# EAGLE design Qwiic-OpenLog (EAGLE 9.2.0)
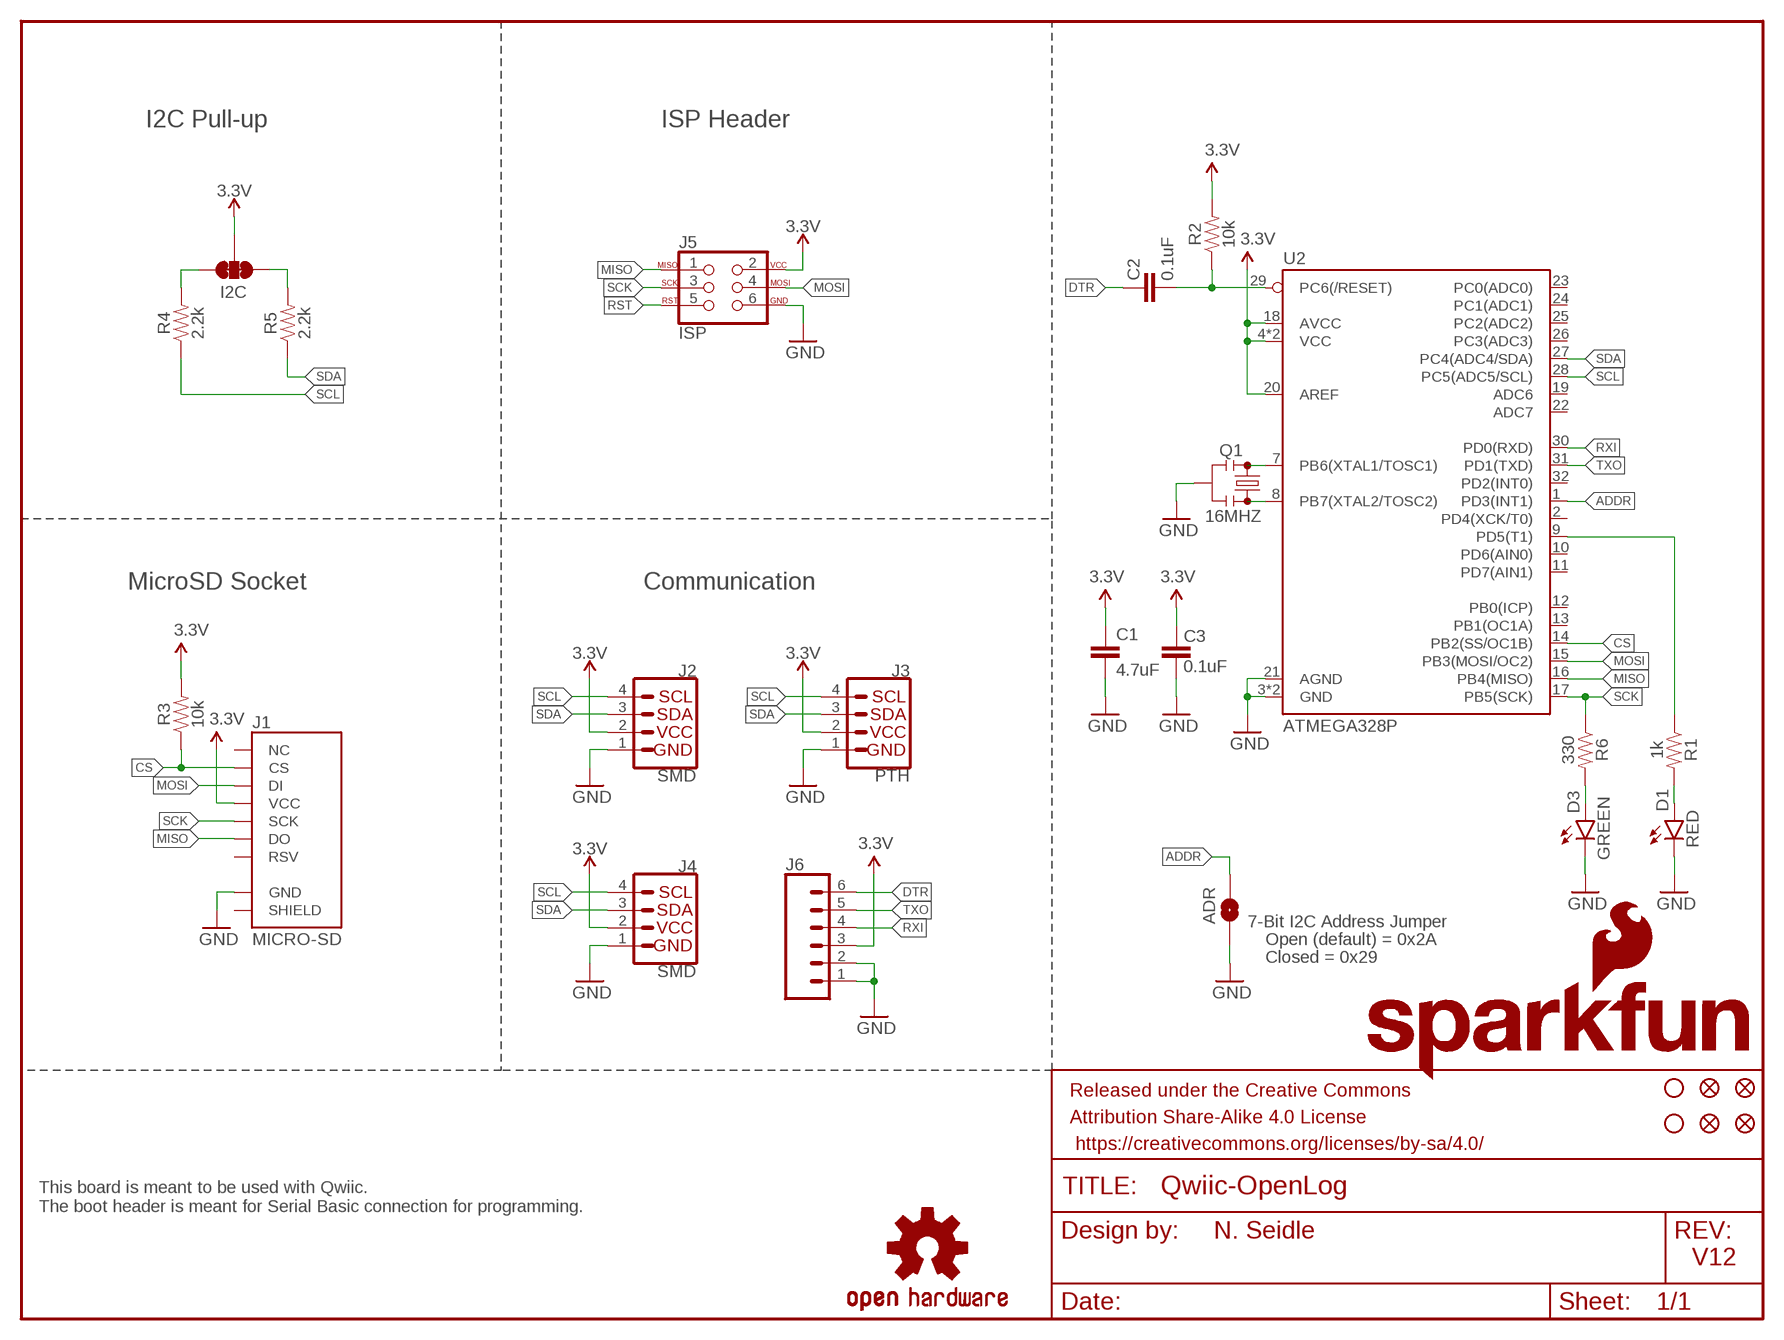
[diagram p0: schematic, sheet 1]

## Parts
ADR  SOLDERJUMPERNO  [SJ_2S-NO]
C1  4.7uF  4.7UF-0603-6.3V-(10%)  [0603]
C2  0.1uF  0.1UF-0603-25V-(+80/-20%)  [0603]
C3  0.1uF  0.1UF-0603-25V-(+80/-20%)  [0603]
D1  RED  LED-RED0603  [LED-0603]
D3  GREEN  LED-GREEN0603  [LED-0603]
FID1  FIDUCIALUFIDUCIAL  [FIDUCIAL-MICRO]
FID2  FIDUCIALUFIDUCIAL  [FIDUCIAL-MICRO]
FID3  FIDUCIALUFIDUCIAL  [FIDUCIAL-MICRO]
FID4  FIDUCIALUFIDUCIAL  [FIDUCIAL-MICRO]
FRAME1  FRAME-LETTER  [CREATIVE_COMMONS]
I2C  JUMPER-SMT_3_2-NC_TRACE_SILK  [SMT-JUMPER_3_2-NC_TRACE_SILK]
J1  MICRO-SD  MICRO-SD_CARD_SOCKETPUSH-PUSH  [MICRO-SD-SOCKET]
J2  SMD  QWIIC_CONNECTORJS-1MM  [1X04_1MM_RA]
J3  PTH  I2C_STANDARD_NO_SILK  [1X04_NO_SILK]
J4  SMD  QWIIC_CONNECTORJS-1MM  [1X04_1MM_RA]
J5  ISP  AVR_SPI_PROG_3X2TESTPOINTS  [2X3_TEST_POINTS]
J6  CONN_06NO_SILK_NO_POP  [1X06_NO_SILK]
JP3  STAND-OFF  [STAND-OFF]
JP4  STAND-OFF  [STAND-OFF]
LOGO1  SFE_LOGO_FLAME.1_INCH  [SFE_LOGO_FLAME_.1]
LOGO2  OSHW-LOGOMINI  [OSHW-LOGO-MINI]
LOGO4  SFE_LOGO_NAME_FLAME.1_INCH  [SFE_LOGO_NAME_FLAME_.1]
Q1  16MHZ  RESONATOR16MHZ  [RESONATOR-SMD]
R1  1k  1KOHM-0603-1/10W-1%  [0603]
R2  10k  10KOHM-0603-1/10W-1%  [0603]
R3  10k  10KOHM-0603-1/10W-1%  [0603]
R4  2.2k  2.2KOHM-0603-1/10W-1%  [0603]
R5  2.2k  2.2KOHM-0603-1/10W-1%  [0603]
R6  330  330OHM-0603-1/10W-1%  [0603]
U2  ATMEGA328P  ATMEGA328P_TQFP  [TQFP32-08]

## Nets
3.3V: C1.1 C3.2 I2C.2 J1.VCC J2.2 J3.2(VCC) J4.2 J5.2 J6.3 R2.2 R3.2 U2.4(VCC) U2.6(VCC) U2.18(AVCC) U2.20(AREF)
ADDR: ADR.2 U2.1(PD3(INT1))
CS: J1.CS R3.1 U2.14(PB2(SS/OC1B))
DTR: C2.2 J6.6
GND [vcc]: ADR.1 C1.2 C3.1 D1.C D3.C J1.GND J2.1 J3.1(GND) J4.1 J5.6 J6.1 J6.2 Q1.2 U2.3(GND) U2.5(GND) U2.21(AGND)
MISO: J1.DO J5.1 U2.16(PB4(MISO))
MOSI: J1.DI J5.4 U2.15(PB3(MOSI/OC2))
N$1: Q1.1 U2.8(PB7(XTAL2/TOSC2))
N$2: Q1.3 U2.7(PB6(XTAL1/TOSC1))
N$3: D1.A R1.2
N$4: R1.1 U2.9(PD5(T1))
N$5: I2C.1 R5.2
N$6: I2C.3 R4.2
N$7: D3.A R6.2
RST: C2.1 J5.5 R2.1 U2.29(PC6(/RESET))
RXI: J6.4 U2.30(PD0(RXD))
SCK: J1.SCLK(SCK) J5.3 R6.1 U2.17(PB5(SCK))
SCL: J2.4 J3.4(SCL) J4.4 R4.1 U2.28(PC5(ADC5/SCL))
SDA: J2.3 J3.3(SDA) J4.3 R5.1 U2.27(PC4(ADC4/SDA))
TXO: J6.5 U2.31(PD1(TXD))
Unconnected: J1.CD1(SHIELD) J1.RSV1(RSV) J1.RSV2(NC) U2.2(PD4(XCK/T0)) U2.10(PD6(AIN0)) U2.11(PD7(AIN1)) U2.12(PB0(ICP)) U2.13(PB1(OC1A)) U2.19(ADC6) U2.22(ADC7) U2.23(PC0(ADC0)) U2.24(PC1(ADC1)) U2.25(PC2(ADC2)) U2.26(PC3(ADC3)) U2.32(PD2(INT0))

## Notes on the sheet
- I2C Pull-up | ISP Header
- MicroSD Socket | Communication
- 7-Bit I2C Address Jumper
- Open (default) = 0x2A
- Closed = 0x29
- This board is meant to be used with Qwiic. 
  The boot header is meant for Serial Basic connection for programming.
- N. Seidle
- V12

## Library data of the parts
ADR = SparkFun:SOLDERJUMPER: Solder Jumper Standard SMD solder jumper. Used to automate production. Two varients : Normally Open and Normally Closed are the same, but have different paste layers. NC will have a large amount of paste and should jumper during reflow.
C1 = SparkFun-Capacitors:4.7UF: 4.7µF ceramic capacitors A capacitor is a passive two-terminal electrical component used to store electrical energy temporarily in an electric field.; PROD_ID: CAP-08280
C2 C3 = SparkFun-Capacitors:0.1UF: 0.1µF ceramic capacitors A capacitor is a passive two-terminal electrical component used to store electrical energy temporarily in an electric field.; PROD_ID: CAP-00810
D1 = SparkFun-LED:LED-RED: Red SMD LED Used in manufacturing of most products at SparkFun Packages: 0603 - SMD 0603 package [Product Link] <http://docs.avagotech.com/docs/AV02-0551EN> 0603 SMART - SMD 0603 SMART package ( more efficient and expensive)[Product Link] <http://www.osram-os.com/Graphics/XPic2/00077099_0.pdf> 1206 - SMD1206 package [Product Link] <https://www.sparkfun.com/datasheets/DevTools/LilyPad/Q150OVS4.pdff> SparkFun Products: Pro Mini 328 -5V <https://www.sparkfun.com/products/821> RedBoard <https://www.sparkfun.com/products/12757> IOIO-OTG <https://www.sparkfun.com/products/13613>; PROD_ID: DIO-00819
D3 = SparkFun-LED:LED-GREEN: Green SMD LED Used in manufacturing of various products at SparkFun Packages: 0603 - SMD 0603 package [Product Link] <http://www.futureelectronics.com/en/technologies/semiconductors/optoelectronics/leds/Pages/9894312-LTST-C190GKT.aspx?CrossPart=HSMG-C190&IM=0> LilyPad 1206 - SMD1206 LilyPad package [Product Link] <http://www.futureelectronics.com/en/Technologies/Product.aspx?ProductID=IN150NGHARVATEKCORPORATION2049943&IM=0> 1206 - SMD1206 package [Product Link] <http://www.futureelectronics.com/en/technologies/semiconductors/optoelectronics/leds/Pages/8315665-LTST-C150KGKT.aspx?IM=0> 1206 Bottom Mount -SMD 1206 Bottom Mount [Product Link] <http://www.digikey.com/product-detail/en/lite-on-inc/LTST-C230KGKT/160-1456-1-ND/386854> SparkFun Products: Pro Mini 328 -5V <https://www.sparkfun.com/products/821> RedBoard <https://www.sparkfun.com/products/12757> MP3 Trigger <https://www.sparkfun.com/products/13720> Makey Makey <https://www.sparkfun.com/products/11076>; PROD_ID: DIO-00821
FID1-FID4 = SparkFun-Aesthetics:FIDUCIAL: Fiducial Alignment Points Point-of-reference for pick-and-place machines and other optical instruments.
FRAME1 = SparkFun-Aesthetics:FRAME-LETTER: Schematic Frame - Letter Standard 8.5x11 US Letter frame
I2C = SparkFun-Jumpers:JUMPER-SMT_3_2-NC_TRACE: Normally closed trace jumper (2 of 2 connections) This jumper has a trace between all three pads so they are normally closed (NC). Use a razor knife to open the connection(s). For best results follow the IPC guidelines for cutting traces: Cutout at least 0.063 mm (0.005 in). Remove all loose material to clean up the cut area. Seal the cut with an approved epoxy. Reapply solder to reclose the connection(s).
J1 = SparkFun-Connectors:MICRO-SD_CARD_SOCKET: microSD Socket for Transflash Push-push type µSD socket. tDoc lines correctly indicate media card edge positions when inserting (unlocked, locked, depressed). NOTE: CD1 and CD2 are connected internally, and the default detect state of the socket is detect pin to ground. SparkFun Products: WAV Trigger <https://www.sparkfun.com/products/13660> CAN-Bus Shield <https://www.sparkfun.com/products/13262> SparkFun Level Shifing microSD Breakout <https://www.sparkfun.com/products/13743>; PROD_ID: CONN-07820
J2 J4 = SparkFun-Connectors:QWIIC_CONNECTOR: SparkFun I2C Standard Qwiic Connector An SMD 1mm pitch JST connector makes it easy and quick (get it? Qwiic?) to connect I2C devices to each other. The Qwiic system <http://www.sparkfun.com/qwiic> enables fast and solderless connection between popular platforms and various sensors and actuators. We carry 200mm <https://www.sparkfun.com/products/14204>, 100mm <https://www.sparkfun.com/products/14205>, 50mm <https://www.sparkfun.com/products/14206>, and breadboard friendly <https://www.sparkfun.com/products/14207> Qwiic cables. We also offer 10 pcs strips <https://www.sparkfun.com/products/14323> the SMD connectors.; PROD_ID: CONN-13694
J3 = SparkX:I2C_STANDARD: SparkFun I2C Standard Pinout Header SparkFun has standardized on a pinout for all I2C based sensor breakouts. This pinout allows I2C boards to be plugged directly into the headers on Arduino Uno compatible boards, and to be daisy chained easily. Example SparkFun Products: SparkFun Atmospheric Sensor Breakout - BME280 <https://www.sparkfun.com/products/13676> SparkFun Altitude/Pressure Sensor Breakout - MPL3115A2 <https://www.sparkfun.com/products/11084> SparkFun TOF Range Finder Sensor - VL6180 <https://www.sparkfun.com/products/12785>
J5 = SparkFun-Connectors:AVR_SPI_PROG_3X2: AVR ISP 6 Pin This is the reduced ISP connector for AVR programming. Common on Arduino. This footprint will take up less PCB space and can be used with a 10-pin to 6-pin adapter such as SKU: BOB-08508 **Special note about "TEST_POINT" package. The stop mask is on the top side, so if you want your programming test points to be on the bottom of your board, make sure to place this package on the bottom side of the board. This also ensure that the orientation to program from the bottom side will be correct. SparkFun Products: SparkFun ISP Pogo Adapter <https://www.sparkfun.com/products/11591> - NS Tiny AVR Programmer <https://www.sparkfun.com/products/11801> -PTH
J6 = SparkFun-Connectors:CONN_06: Multi connection point. Often used as Generic Header-pin footprint for 0.1 inch spaced/style header connections On any of the 0.1 inch spaced packages, you can populate with these: Break Away Headers - Straight <https://www.sparkfun.com/products/116> (PRT-00116) Break Away Male Headers - Right Angle <https://www.sparkfun.com/products/553> (PRT-00553) Female Headers <https://www.sparkfun.com/products/115> (PRT-00115) Break Away Headers - Machine Pin <https://www.sparkfun.com/products/117> (PRT-00117) Break Away Female Headers - Swiss Machine Pin <https://www.sparkfun.com/products/743> (PRT-00743) Arduino Stackable Header - 6 Pin <https://www.sparkfun.com/products/9280> (PRT-09280) For SCREWTERMINALS and SPRING TERMINALS visit here: Screw Terimnals on SparkFun.com <https://www.sparkfun.com/search/results?term=Screw+Terminals> (5mm/3.5mm/2.54mm spacing) This device is also useful as a general connection point to wire up your design to another part of your project. Our various solder wires solder well into these plated through hole pads. Hook-Up Wire - Assortment (Stranded, 22 AWG) <https://www.sparkfun.com/products/11375> (PRT-11375) Hook-Up Wire - Assortment (Solid Core, 22 AWG) <https://www.sparkfun.com/products/11367> (PRT-11367) View the entire wire category on our website here <https://www.sparkfun.com/categories/141>
JP3 JP4 = SparkFun:STAND-OFF: Stand Off This is the mechanical footprint for a #4 phillips button head screw. Use the keepout ring to avoid running the screw head into surrounding components. SKU : PRT-00447
LOGO1 = SparkFun-Aesthetics:SFE_LOGO_FLAME: SparkFun Flame Logo This is the SparkFun flame logo. The logo on the schematic will always be the same size; the package variant is the height of the flame. Default layer for the logo on the board is tSilk.
LOGO2 = SparkFun-Aesthetics:OSHW-LOGO: Open-Source Hardware (OSHW) Logo This logo indicates the piece of hardware it is found on incorporates a OSHW license and/or adheres to the definition of open source hardware found here: http://freedomdefined.org/OSHW
LOGO4 = SparkFun-Aesthetics:SFE_LOGO_NAME_FLAME: SparkFun Font Logo w/ Flame This is the SparkFun full logo. The logo on the schematic will always be the same size; the package variant is the height of the flame part of the logo. Default layer for the logo on the board is tSilk.
Q1 = SparkFun-FreqCtrl:RESONATOR: Resonator Small SMD resonator. Used, eg, on the Arduino Pro/ Pro Mini boards. 8MHz- XTAL-08895 16MHz- XTAL-08900; PROD_ID: XTAL-08900
R1 = SparkFun-Resistors:1KOHM: 1kΩ resistor A resistor is a passive two-terminal electrical component that implements electrical resistance as a circuit element. Resistors act to reduce current flow, and, at the same time, act to lower voltage levels within circuits. - Wikipedia; PROD_ID: RES-07856
R2 R3 = SparkFun-Resistors:10KOHM: 10kΩ resistor A resistor is a passive two-terminal electrical component that implements electrical resistance as a circuit element. Resistors act to reduce current flow, and, at the same time, act to lower voltage levels within circuits. - Wikipedia; PROD_ID: RES-00824
R4 R5 = SparkFun-Resistors:2.2KOHM: 2.2kΩ resistor A resistor is a passive two-terminal electrical component that implements electrical resistance as a circuit element. Resistors act to reduce current flow, and, at the same time, act to lower voltage levels within circuits. - Wikipedia; PROD_ID: RES-08272
R6 = SparkFun-Resistors:330OHM: 330Ω resistor A resistor is a passive two-terminal electrical component that implements electrical resistance as a circuit element. Resistors act to reduce current flow, and, at the same time, act to lower voltage levels within circuits. - Wikipedia; PROD_ID: RES-00818
U2 = SparkFun-IC-Microcontroller:ATMEGA328P_TQFP: Popular 328P in QFP Storefront component: ATmega328 - TQFP <https://www.sparkfun.com/products/13448> (COM-13448) Datasheet <http://www.sparkfun.com/datasheets/Components/SMD/ATMega328.pdf> SparkFun Products SparkFun RedBoard - Programmed with Arduino <https://www.sparkfun.com/products/12757> (DEV-12757) Arduino Pro Mini 328 - 5V/16MHz <https://www.sparkfun.com/products/11113> (DEV-11113) Arduino Pro Mini 328 - 3.3V/8MHz <https://www.sparkfun.com/products/11114> (DEV-11114) SparkFun OpenLog <https://www.sparkfun.com/products/13712> (DEV-13712) SparkFun MicroView - OLED Arduino Module <https://www.sparkfun.com/products/12923> (DEV-12923) SparkFun Digital Sandbox <https://www.sparkfun.com/products/12651> (DEV-12651) SparkFun PicoBoard <https://www.sparkfun.com/products/11888> (WIG-11888) Arduino Fio <https://www.sparkfun.com/products/10116> (DEV-10116) LilyPad Arduino 328 Main Board <https://www.sparkfun.com/products/13342> (DEV-13342) SparkFun RedStick <https://www.sparkfun.com/products/13741> (DEV-13741) LilyPad MP3 <https://www.sparkfun.com/products/11013> (DEV-11013) LilyPad Arduino SimpleSnap <https://www.sparkfun.com/products/10941> (DEV-10941) SparkFun Stepoko <https://www.sparkfun.com/products/13899> (ROB-13899) SparkFun Geiger Counter <https://www.sparkfun.com/products/11345> (SEN-11345) SparkFun EL Sequencer <https://www.sparkfun.com/products/12781> (COM-12781) Arduino Pro 328 - 5V/16MHz <https://www.sparkfun.com/products/10915> (DEV-10915) CryptoCape <https://www.sparkfun.com/products/12773> (DEV-12773) SparkFun IR Thermometer Evaluation Board - MLX90614 <https://www.sparkfun.com/products/10740> (SEN-10740) SparkFun RedBot Mainboard <https://www.sparkfun.com/products/12097> (ROB-12097) Arduino Pro 328 - 3.3V/8MHz <https://www.sparkfun.com/products/10914> (DEV-10914) SparkFun Block for Intel® Edison - Arduino <https://www.sparkfun.com/products/13036> (DEV-13036) SparkFun Simon Says - Surface Mount Soldering Kit <https://www.sparkfun.com/products/10935> (KIT-10935) SparkFun 7-Segment Serial Display - Red <https://www.sparkfun.com/products/11441> (COM-11441) SparkFun 7-Segment Serial Display - White <https://www.sparkfun.com/products/11629> (COM-11629) SparkFun 7-Segment Serial Display - Yellow <https://www.sparkfun.com/products/11443> (COM-11443) SparkFun 7-Segment Serial Display - Kelly Green <https://www.sparkfun.com/products/11440> (COM-11440) SparkFun 7-Segment Serial Display - Blue <https://www.sparkfun.com/products/11442> (COM-11442) SparkFun OpenSegment Serial Display - 20mm (Blue) <https://www.sparkfun.com/products/11647> (COM-11647) SparkFun OpenSegment Serial Display - 20mm (Green) <https://www.sparkfun.com/products/11646> (COM-11646) SparkFun OpenSegment Serial Display - 20mm (White) <https://www.sparkfun.com/products/11648> (COM-11648) SparkFun OpenSegment Serial Display - 20mm (Red) <https://www.sparkfun.com/products/11644> (COM-11644) SparkFun OpenSegment Serial Display - 20mm (Yellow) <https://www.sparkfun.com/products/11645> (COM-11645) SparkFun OpenSegment Shield <https://www.sparkfun.com/products/13190> (DEV-13190); PROD_ID: IC-09069; VALUE: ATMEGA328P_TQFP

## Net classes
1 vcc: width 0.152 mm

## Board
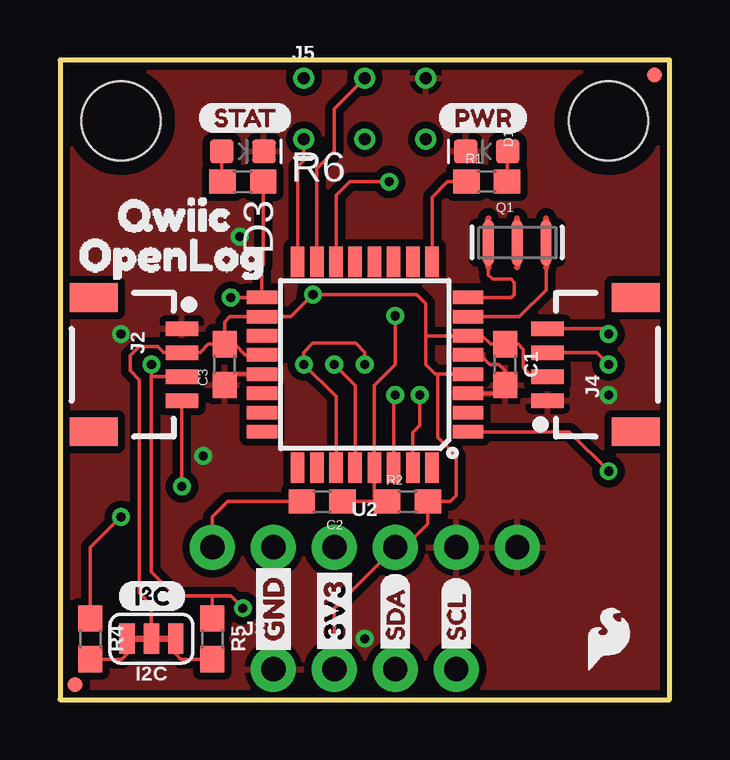
[diagram p1: board, top side]
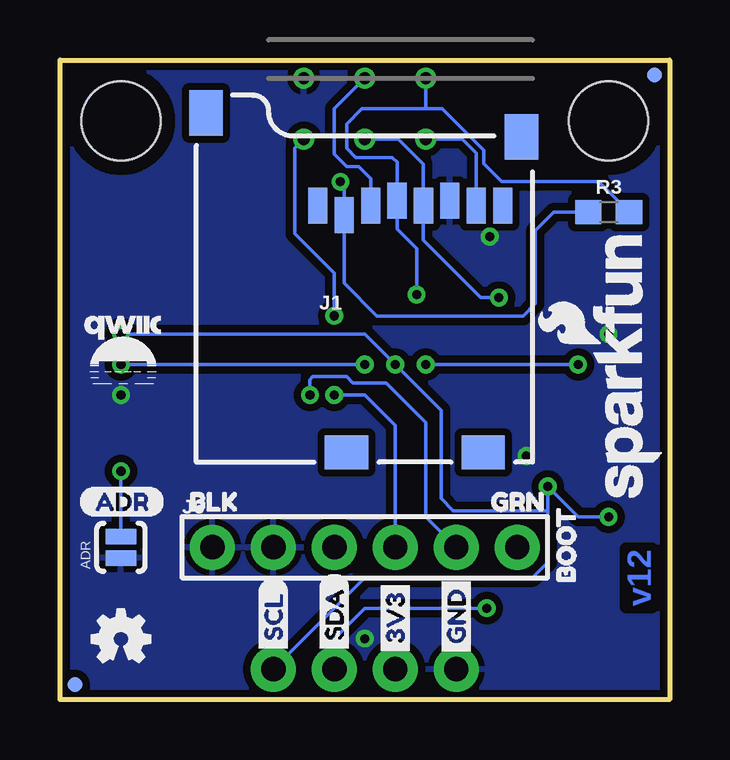
[diagram p2: board, bottom side, seen from below]

Size 25.4 x 26.67 mm. Coordinates in mm from the lower left corner, seen from the top.
Outline: 25.4,0 25.4,26.67 0,26.67 0,0 25.4,0
Copper layers (1*16): Top 0.035mm / dielectric 1.5mm / Bottom 0.035mm
Design rules "SparkFun-2-layer-PCBWay-LIMIT": minimum track width 6mil, minimum drill 0.3mm, track to track 6mil, track to pad 6mil, pad to pad 6mil, via to via 6mil, smd to smd 6mil, copper to edge 6mil, drill to drill 6mil, minimum pad ring 7mil, minimum via ring 7mil, stop-mask expansion 4mil, vias tented up to drill 25mil, thermal gap 10mil

### Footprints (pad centres in the part's own frame; a part is rotated, then mirrored left to right if it is on the bottom)
SJ_2S-NO = smd 0.635 x 1.27: 1 -0.45,0; 2 0.45,0
0603 = smd 1.1 x 1: 1 -0.85,0; 2 0.85,0
LED-0603 = smd 1 x 1: A -0.877,0; C 0.877,0
FIDUCIAL-MICRO = smd 0.635 x 0.635: 1 0,0
SMT-JUMPER_3_2-NC_TRACE_SILK = smd 0.635 x 1.27: 1 -1.016,0; 2 0,0; 3 1.016,0
MICRO-SD-SOCKET = smd 1.8 x 1.4: CD1 -2.05,0.4; CD2 -7.75,0.4 | smd 0.8 x 1.5: CS -7.84,10.3; DI -6.74,10.7; DO -2.34,10.7; GND -3.44,10.9; RSV1 -8.94,10.7; RSV2 -1.24,10.7; SCLK -4.54,10.7; VCC -5.64,10.9 | smd 1.4 x 1.9: GND1 -13.6,14.55; GND3 -0.45,13.55
1X04_1MM_RA = smd 0.6 x 1.35: 1 -1.5,0; 2 -0.5,0; 3 0.5,0; 4 1.5,0 | smd 1.2 x 2: NC1 2.8,-3.675; NC2 -2.8,-3.675
1X04_NO_SILK = drill 1.016 pad 1.88: 1 0,0; 2 2.54,0; 3 5.08,0; 4 7.62,0
2X3_TEST_POINTS = drill 0.508: 1 -2.54,-1.27; 2 -2.54,1.27; 3 0,-1.27; 4 0,1.27; 5 2.54,-1.27; 6 2.54,1.27
1X06_NO_SILK = drill 1.016 pad 1.88: 1 0,0; 2 2.54,0; 3 5.08,0; 4 7.62,0; 5 10.16,0; 6 12.7,0
STAND-OFF = hole 3.302: 0,0
RESONATOR-SMD = smd 0.45 x 1.905: 1 -1.2,0; 2 0,0; 3 1.2,0
TQFP32-08 = smd 1.27 x 0.559: 1 -4.293,2.8; 2 -4.293,2; 3 -4.293,1.2; 4 -4.293,0.4; 5 -4.293,-0.4; 6 -4.293,-1.2; 7 -4.293,-2; 8 -4.293,-2.8; 17 4.293,-2.8; 18 4.293,-2; 19 4.293,-1.2; 20 4.293,-0.4; 21 4.293,0.4; 22 4.293,1.2; 23 4.293,2; 24 4.293,2.8 | smd 0.559 x 1.27: 9 -2.8,-4.293; 10 -2,-4.293; 11 -1.2,-4.293; 12 -0.4,-4.293; 13 0.4,-4.293; 14 1.2,-4.293; 15 2,-4.293; 16 2.8,-4.293; 25 2.8,4.293; 26 2,4.293; 27 1.2,4.293; 28 0.4,4.293; 29 -0.4,4.293; 30 -1.2,4.293; 31 -2,4.293; 32 -2.8,4.293

### Placement (x,y rotation side)
ADR  22.86,6.35 90 bottom
C1  18.54,13.97 270 top
C2  10.92,8.26 180 top
C3  6.86,13.97 90 top
D1  17.78,22.86 180 top
D3  7.62,22.86 0 top
FID1  24.77,26.04 0 top
FID2  0.64,0.64 0 top
FID3  24.77,0.64 180 bottom
FID4  0.64,26.04 0 bottom
FRAME1  -21.06,-15.24 0 top  (outside the outline)
I2C  3.81,2.54 180 top
J1  5.71,9.91 0 bottom
J2  5.08,13.97 270 top
J3  8.89,1.27 0 top
J4  20.32,13.97 90 top
J5  12.7,24.64 0 top
J6  19.05,6.35 0 bottom
JP3  2.54,24.13 0 top
JP4  22.86,24.13 0 top
LOGO1  22.86,2.54 0 top
LOGO2  22.86,2.54 0 bottom
LOGO4  1.78,13.97 90 bottom
Q1  19.05,19.05 0 top
R1  17.78,21.59 0 top
R2  14.48,8.26 0 top
R3  2.54,20.32 0 bottom
R4  1.27,2.54 270 top
R5  6.35,2.54 270 top
R6  7.62,21.59 180 top
U2  12.7,13.97 180 top
U$3  [QWIIC-LOGO-SMALL]  22.86,13.97 0 bottom
U$4  [3V3-03]  11.43,1.65 90 top
U$5  [GND-03]  8.89,1.65 90 top
U$6  [3V30]  11.43,1.65 90 bottom
U$7  [ADR-()-03]  24.64,8.26 0 bottom
U$8  [I_SUPER2_C-()-03]  2.41,4.32 0 top
U$9  [PWR-()-03]  15.75,24.26 0 top
U$10  [BLK3]  20.7,8.26 0 bottom
U$11  [BOOT5]  4.32,4.19 90 bottom
U$12  [GRN4]  8.13,8.26 0 bottom
U$13  [SDA1]  13.97,1.78 90 bottom
U$14  [QWIIC7]  1.27,20.19 0 top
U$15  [SCL2]  16.51,1.78 90 bottom
U$16  [SDA1]  13.97,1.78 90 top
U$17  [STAT0]  5.71,24.26 0 top
U$18  [OPENLOG0]  -0.38,18.54 0 top
U$19  [SCL2]  16.51,1.78 90 top
U$20  [GND1]  8.89,1.65 90 bottom

### Tracks (layer width: path | path; a pad name or v marks a point on that pad's centre or on a via)
3.3V  (via drill 0.38)
  Top 0.152: C3.2 6.18,14.82 5.83,14.47 J2.2 4.33,14.47 4.06,14.73 3.3,14.73 2.92,14.35 2.92,13.72 3.3,13.34 3.3,4.45 3.81,3.94 I2C.2 | U2.20 7.73,14.37 7.28,14.82 C3.2 | 15.24,15.17 U2.6 17.6,15.17 17.95,14.82 C1.1 19.09,14.82 19.3,14.61 19.3,13.84 19.68,13.47 J4.2 | 15.24,15.17 15.24,13.97 15.64,13.57 15.75,13.57 | 15.75,13.57 15.75,10.92 16.51,10.16 16.51,8.51 16.26,8.26 R2.2 15.33,7.33 14.35,6.35 J6.3 11.43,3.81 J3.2 | U2.4 15.75,13.57 | 15.24,15.17 15.24,16.51 14.86,16.89 v10.54,16.89 9.62,15.97 U2.18 7.08,15.97 6.86,15.75 C3.2
  Bottom 0.152: 10.16,24.64 9.47,24.64 7.75,22.91 7.75,22.36 6.99,21.59 2.96,21.59 R3.2 | 10.16,24.64 12.83,24.64 13.46,24 13.46,22.99 13.08,22.61 11.56,22.61 11.36,22.4 J1.VCC 11.36,19.61 10.54,18.8 v10.54,16.89 | J5.2 10.16,24.64
ADDR  (via drill 0.38)
  Top 0.152: U2.1 21.21,11.17 v22.86,9.53
  Bottom 0.152: v22.86,9.53 ADR.2
CS  (via drill 0.38)
  Top 0.152: U2.14 11.5,21.02 12.06,21.59 v13.72,21.59
  Bottom 0.152: v13.72,21.59 13.55,21.43 J1.CS 13.55,17.36 12.19,16 6.1,16 5.59,16.51 5.59,19.56 4.83,20.32 R3.1
DTR
  Top 0.152: C2.2 6.99,8.26 6.35,7.62 J6.6
GND  (via drill 0.38)
  Top 0.152: 7.28,13.12 C3.1 7.31,13.57 U2.21 | U2.3 18.19,12.77 C1.2 18.54,13.72 18.29,13.97 17.91,13.97 17.51,14.37 U2.5
  other vias: 22.86,12.7 2.54,15.24 5.97,10.16 12.7,2.54 7.49,19.3
  pour Top (isolate 0.305): 25.4,0 0,0 0,26.67 25.4,26.67
  pour Bottom (isolate 0.305): 25.4,0 0,0 0,26.67 25.4,26.67
MISO
  Top 0.152: U2.16 9.9,22.22 10.16,22.48 J5.1
  Bottom 0.152: J5.1 8.64,23.37 8.05,22.79 J1.DO
MOSI
  Top 0.152: U2.15 10.7,22.13 11.43,22.86 11.43,24.64 J5.4
  Bottom 0.152: J5.4 13.97,24.64 13.97,22.73 13.46,22.23 12.95,22.23 12.46,21.73 J1.DI
N$1
  Top 0.152: U2.8 18.8,16.77 18.92,16.89 18.92,17.4 18.8,17.53 18.03,17.53 17.85,17.71 Q1.1
N$2
  Top 0.152: U2.7 19.14,15.97 20.25,17.07 Q1.3
N$3
  Top 0.152: R1.2 18.63,22.83 D1.A
N$4
  Top 0.152: U2.9 15.5,20.96 16.13,21.59 R1.1
N$5
  Top 0.152: I2C.1 4.83,1.91 5.04,1.69 R5.2
N$6
  Top 0.152: R4.2 2.58,1.69 2.79,1.91 I2C.3
N$7
  Top 0.152: D3.A 6.74,21.62 R6.2
RST  (via drill 0.38)
  Top 0.152: R2.1 13.08,8.26 | 13.08,8.26 C2.1 | v13.97,16 13.97,13.97 13.1,13.1 U2.29 13.1,8.27 13.08,8.26
  Bottom 0.152: v13.97,16 13.97,17.78 15.62,19.43 15.62,22.99 J5.5
RXI  (via drill 0.38)
  Top 0.152: U2.30 13.9,12.63 v13.97,12.7
  Bottom 0.152: J6.4 11.43,11.43 12.7,12.7 v13.97,12.7
SCK  (via drill 0.38)
  Top 0.152: R6.1 8.47,18.12 8.41,18.06 U2.17 v7.12,16.77 v7.11,16.76
  Bottom 0.152: v7.11,16.76 v7.12,16.77 7.87,16.77 10.26,19.15 J1.SCLK 10.26,22.32 10.48,22.54 11.3,23.37 J5.3
SCL  (via drill 0.38)
  Top 0.152: R4.1 1.27,6.35 v2.54,7.62 | J2.4 v5.08,8.89 | U2.28 12.3,13.1 v11.43,13.97 | J4.4 22.63,15.47 v22.86,15.24
  Bottom 0.152: v22.86,15.24 12.7,15.24 v11.43,13.97 9.53,12.06 9.53,8.38 9.02,7.87 5.08,7.87 | J3.4 12.7,5.08 5.71,5.08 5.08,5.71 5.08,7.87 | 5.08,7.87 v5.08,8.89 3.81,7.62 v2.54,7.62
SDA  (via drill 0.38)
  Top 0.152: v3.81,13.97 3.81,13.46 | U2.27 11.5,12.63 v10.16,13.97 10.16,14.48 10.54,14.86 12.32,14.86 12.7,14.48 v12.7,13.97 | J2.3 3.82,13.47 3.81,13.46 | J4.3 22.36,14.47 v22.86,13.97 | 3.81,13.46 3.81,5.33 4.83,4.32 6.35,4.32 | 6.35,4.32 7.11,4.32 v7.62,3.81 | R5.1 6.35,4.32
  Bottom 0.152: v10.16,13.97 v3.81,13.97 | v12.7,13.97 v22.86,13.97 | J3.3 13.97,2.54 12.7,3.81 v7.62,3.81
TXO  (via drill 0.38)
  Top 0.152: U2.31 14.7,11.14 14.99,11.43 v14.99,12.7
  Bottom 0.152: J6.5 10.16,7.62 10.16,11.56 11.81,13.21 13.21,13.21 13.46,13.46 14.86,13.46 14.99,13.34 v14.99,12.7

### Text on the board
Bottom: v12
tValues: Qwiic | Qwiic
tDocu: N. Seidle